# EAGLE design Boost_Mini (EAGLE 9.4.2)
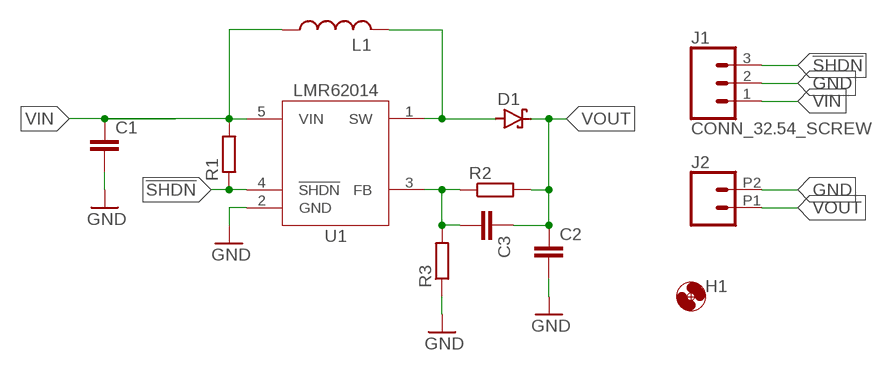
[diagram p0: schematic, sheet 1]

## Parts
C1  C-EUC0805  [C0805]
C2  C-EUC0805  [C0805]
C3  C-EUC0603  [C0603]
D1  DIODE_SCHOTTKYDO-214AC  [DO214AC]
H1  MOUNTING_HOLE2_NP  [2_56]
J1  CONN_32.54_SCREW  [1X03_SCREW]
J2  CONN_022.54_SCREW_ROUND  [1X02_2.54_SCREWTERM_ROUND]
L1  INDUCTORMAIA_4.1X4.1  [WE-MAIA(4.1X4.1)]
R1  R-EU_R0603  [R0603]
R2  R-EU_R0603  [R0603]
R3  R-EU_R0603  [R0603]
U1  LMR62014SOT23  [DBV0005A]

## Nets
!SHDN: J1.3 R1.1 U1.4(!SHDN)
GND: C1.2 C2.2 J1.2 J2.P2 R3.1 U1.2(GND)
N$1: C3.2 R2.1 R3.2 U1.3(FB)
N$2: D1.A L1.P$2 U1.1(SW)
VIN: C1.1 J1.1 L1.P$1 R1.2 U1.5(VIN)
VOUT: C2.1 C3.1 D1.C J2.P1 R2.2

## Library data of the parts
C1-C3 = bschulz_passives:C-EU: CAPACITOR, European symbol
D1 = bschulz:DIODE_SCHOTTKY: Generic Shottky Diode
H1 = bschulz:MOUNTING_HOLE: Genaric Mechanical Mounting Hole Hole diameter based on max body diameter + 15% Keepout ring is for diameter of socket cap screw (minimum required clearance) TPlace ring is for diameter of pan head screw (recomended clearance) Specifications: Socket Cap <http://fastener-express.com/fastener-technical/SocketscapSS-Alloy.pdf> Button Head Socket Cap <http://fastener-express.com/fastener-technical/Button-Socket-alloy.pdf> Pan Head <http://fastener-express.com/fastener-technical/pan-machine-Screws.pdf>
J1 = bschulz:CONN_3: Genaric 3 terminal header Digikey 2.54_SCREW <https://www.digikey.com/product-detail/en/on-shore-technology-inc/OSTVN03A150/ED10562-ND/1588863> 3.5_SCREW <https://www.digikey.com/product-detail/en/on-shore-technology-inc/OSTTE030161/ED2636-ND/614585>; DIGIKEY: ED10562-ND; MF: On Shore; MPN: OSTVN03A150
J2 = bschulz:CONN_02: Genaric 2 terminal header SCREW_2.54 <https://www.digikey.com/product-detail/en/on-shore-technology-inc/OSTVN02A150/ED10561-ND/1588862> 39532_RA <https://www.digikey.com/product-detail/en/molex/0395321002/WM7845-ND/1280696>; DIGIKEY: ED10561-ND; MF: OnShore; MPN: OSTVN02A150
L1 = bschulz:INDUCTOR: Genaric inductor
R1-R3 = bschulz_passives:R-EU_: RESISTOR, European symbol Digikey Parts: Yageo, 0402 <https://www.digikey.com/products/en/resistors/chip-resistor-surface-mount/52?k=&pkeyword=&sv=0&s=4356&sf=1&FV=-1%7C13%2C7%7C2%2C1291%7C39157%2C1989%7C0%2C-8%7C52%2C3%7C1131%2C3%7C2503&quantity=&ColumnSort=0&page=1&stock=1&pageSize=25> Yageo, 0603 <https://www.digikey.com/products/en/resistors/chip-resistor-surface-mount/52?k=&pkeyword=&sv=0&pv1291=39245&sf=1&FV=-5%7C4356%2C-5%7C47360%2C-8%7C52%2C-1%7C13%2C7%7C2%2C1989%7C0&quantity=10&ColumnSort=1000011&page=1&stock=1&pageSize=25> Panasonic, 0603 <https://www.digikey.com/products/en/resistors/chip-resistor-surface-mount/52?k=&pkeyword=&pv252=68&sf=0&FV=ffec373d%2C1c0002%2C142c040c%2C1f140000%2Cffe00034%2C80002%2Cc0001&quantity=&ColumnSort=0&page=1&stock=1&pageSize=25> Panasonic, precision, 0603 <https://www.digikey.com/products/en/resistors/chip-resistor-surface-mount/52?FV=ffec4907%2Cfffc000a%2Cc0172%2C142c040c%2C1f140000%2Cffe00034%2C1c0002&quantity=100&ColumnSort=2085&page=1&stock=1&pageSize=25> Panasonic, 0805 <https://www.digikey.com/products/en/resistors/chip-resistor-surface-mount/52?k=&pkeyword=&pv3=1&sf=0&FV=ffec373d%2C1c0002%2C1f140000%2Cffe00034%2C142c040d&quantity=&ColumnSort=0&page=1&stock=1&pageSize=25> Rohm, current sense <https://www.digikey.com/products/en/resistors/chip-resistor-surface-mount/52?k=&pkeyword=&pv3=1&sf=0&FV=ffecb688%2C1f140000%2Cffe00034%2C1c0002&quantity=&ColumnSort=0&page=1&stock=1&pageSize=25> Vishay, pulse proof automotive <https://www.digikey.com/products/en/resistors/chip-resistor-surface-mount/52?k=&pkeyword=&pv7=2&sf=0&FV=ffec5d6b%2Cffe00034%2C1f140000&quantity=&ColumnSort=0&page=1&stock=1&pageSize=25>; MF: Yageo
U1 = bschulz:LMR62014: LMR62014 - Step-Up Boost Regulator Characteristics: Vin: 2.7V ~ 14V Vout: Vin ~ 20V Output Current (max): 1.4A IQ: 2mA (switching), 0.4mA (not switching), 24nA (shutdown) (typ) Operating Temperature: -40°C to 125°C Digikey: LMR62014XMF/NOPBCT-ND <https://www.digikey.com/product-detail/en/texas-instruments/LMR62014XMF-NOPB/LMR62014XMF-NOPBCT-ND/3527344>; DIGIKEY: LMR62014XMF/NOPBCT-ND; DISP: LMR62014; MF: TI; MPN: LMR62014XMF/NOPB

## Board
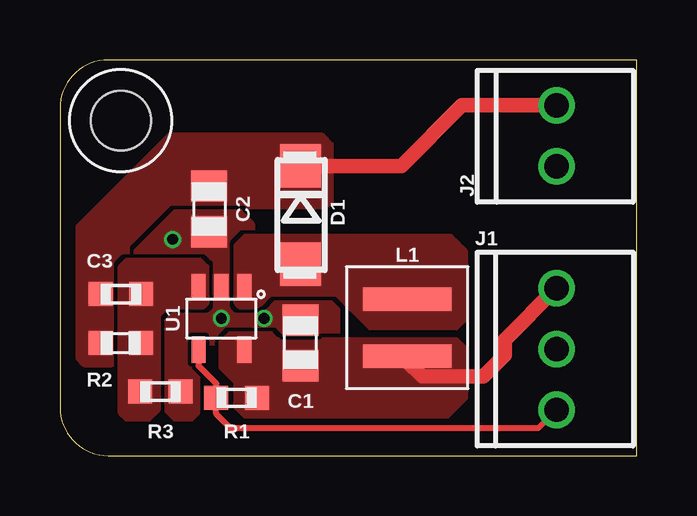
[diagram p1: board, top side]
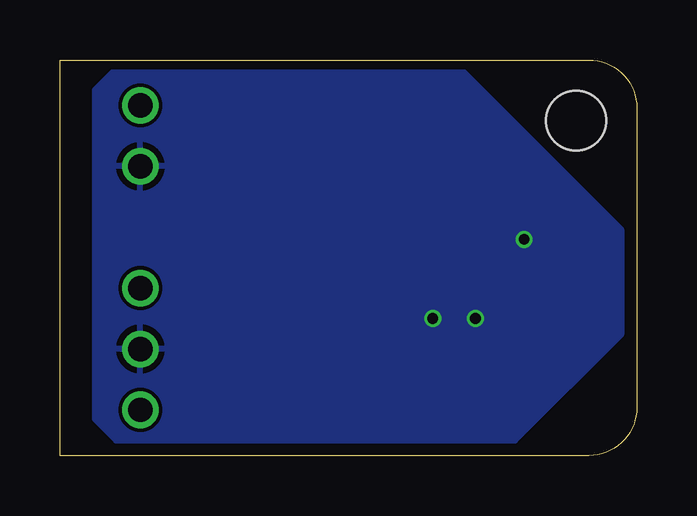
[diagram p2: board, bottom side, seen from below]

Size 24.05 x 16.5 mm. Coordinates in mm from the lower left corner, seen from the top.
Outline: 0,14.5 0,2 arc90 2,0 24.05,0 24.05,16.5 2,16.5 arc90 0,14.5
Copper layers (1*16): Top 0.035559375mm / dielectric 1.6mm / Bottom 0.035559375mm
Design rules "oshpark-2layer": minimum track width 6mil, minimum drill 10mil, track to track 6mil, track to pad 6mil, pad to pad 6mil, via to via 6mil, smd to smd 6mil, copper to edge 15mil, drill to drill 6mil, minimum pad ring 5mil, minimum via ring 5mil, stop-mask expansion 2.5mil, vias tented up to drill 0mil, thermal gap 10mil

### Footprints (pad centres in the part's own frame; a part is rotated, then mirrored left to right if it is on the bottom)
C0805 = smd 1.3 x 1.5: 1 -0.95,0; 2 0.95,0
C0603 = smd 1 x 1: 1 -0.85,0; 2 0.85,0
DO214AC = smd 1.8 x 1.7: A 2.05,0; C -2.05,0
2_56 = hole 2.5: 0,0
1X03_SCREW = drill 1.016: 1 -2.54,0; 2 0,0; 3 2.54,0
1X02_2.54_SCREWTERM_ROUND = drill 1.016: P1 1.27,0; P2 -1.27,0
WE-MAIA(4.1X4.1) = smd 0.98 x 3.7: P$1 -1.185,0; P$2 1.185,0
R0603 = smd 1 x 1: 1 -0.85,0; 2 0.85,0
DBV0005A = smd 1.1 x 0.6: 1 -1.3,0.95; 2 -1.3,0; 3 -1.3,-0.95; 4 1.3,-0.95; 5 1.3,0.95

### Placement (x,y rotation side)
C1  10.03,4.7 90 top
C2  6.22,10.29 270 top
C3  2.54,4.7 0 top
D1  10.03,10.03 270 top
H1  2.54,13.97 0 top
J1  20.7,4.45 270 top
J2  20.7,13.34 90 top
L1  14.48,5.33 90 top
R1  7.37,2.41 0 top
R2  2.54,6.73 180 top
R3  4.19,2.67 180 top
U1  6.73,5.71 270 top

### Tracks (layer width: path | path; a pad name or v marks a point on that pad's centre or on a via)
!SHDN
  Top 0.254: U1.4 5.78,3.74 6.52,3.01 R1.1 6.52,1.74 7.11,1.14 19.94,1.14 J1.3
GND  (via drill 0.45)
  other vias: 4.7,9.02 6.73,5.71 8.51,5.71
  pour Top (rank 3, no thermals): 4.83,10.16 7.49,10.16 8,9.65 8,7.75 9.02,6.73 11.05,6.73 11.56,6.22 11.56,4.95 11.3,4.7 6.22,4.7 5.71,4.19 5.71,1.78 5.46,1.52 4.83,1.52 4.45,1.91 4.45,3.24 2.54,4.19 2.54,7.87
  pour Bottom: 0.64,9.4 7.24,16 21.84,16 22.61,15.24 22.61,1.52 21.72,0.64 5.08,0.64 0.64,5.08
N$1
  pour Top (rank 2, no thermals): 2.79,8.13 5.84,8.13 6.1,7.87 6.1,6.35 5.97,6.22 4.45,6.22 4.06,5.84 4.06,1.91 3.68,1.52 2.79,1.52 2.54,1.78 2.54,7.87
N$2
  pour Top (rank 2, no thermals): 7.75,9.14 16.26,9.14 16.89,8.51 16.89,5.71 16.51,5.33 12.95,5.33 11.56,6.73 8.76,6.73 8.26,6.22 7.49,6.22 7.37,6.35 7.37,8.76
VIN
  Top 0.61: J1.1 18.54,4.83 18.54,4.19 17.65,3.3 15.11,3.3 14.48,3.94 L1.P$1
  pour Top (rank 2, no thermals): 7.11,5.08 8.76,5.08 9.02,4.83 16.51,4.83 16.89,4.45 16.89,2.41 16.13,1.65 7.75,1.65 7.37,2.03 7.37,3.05 6.73,3.68 6.73,4.7
VOUT
  Top 0.61: J2.P1 16.76,14.61 14.24,12.08 D1.C
  pour Top (rank 4, no thermals): 0.76,4.06 1.02,3.81 2.16,3.81 2.41,4.06 2.41,7.75 5.08,10.41 11.05,10.41 11.3,10.67 11.3,12.95 10.92,13.34 4.57,13.34 0.76,9.53

### Text on the board
tDocu: Boost - Mini / Toshi / Bobby Schulz | Vout | GND | Vin | GND | !SHDN
bDocu: Vout | Use With: / LMR62014 / MIC2250 / AP3012 | GND | Vin | GND | !SHDN